# Altium schematic sheet Sheet2.SchDoc
size A4; SheetNumber: 1; SheetTotal: 1
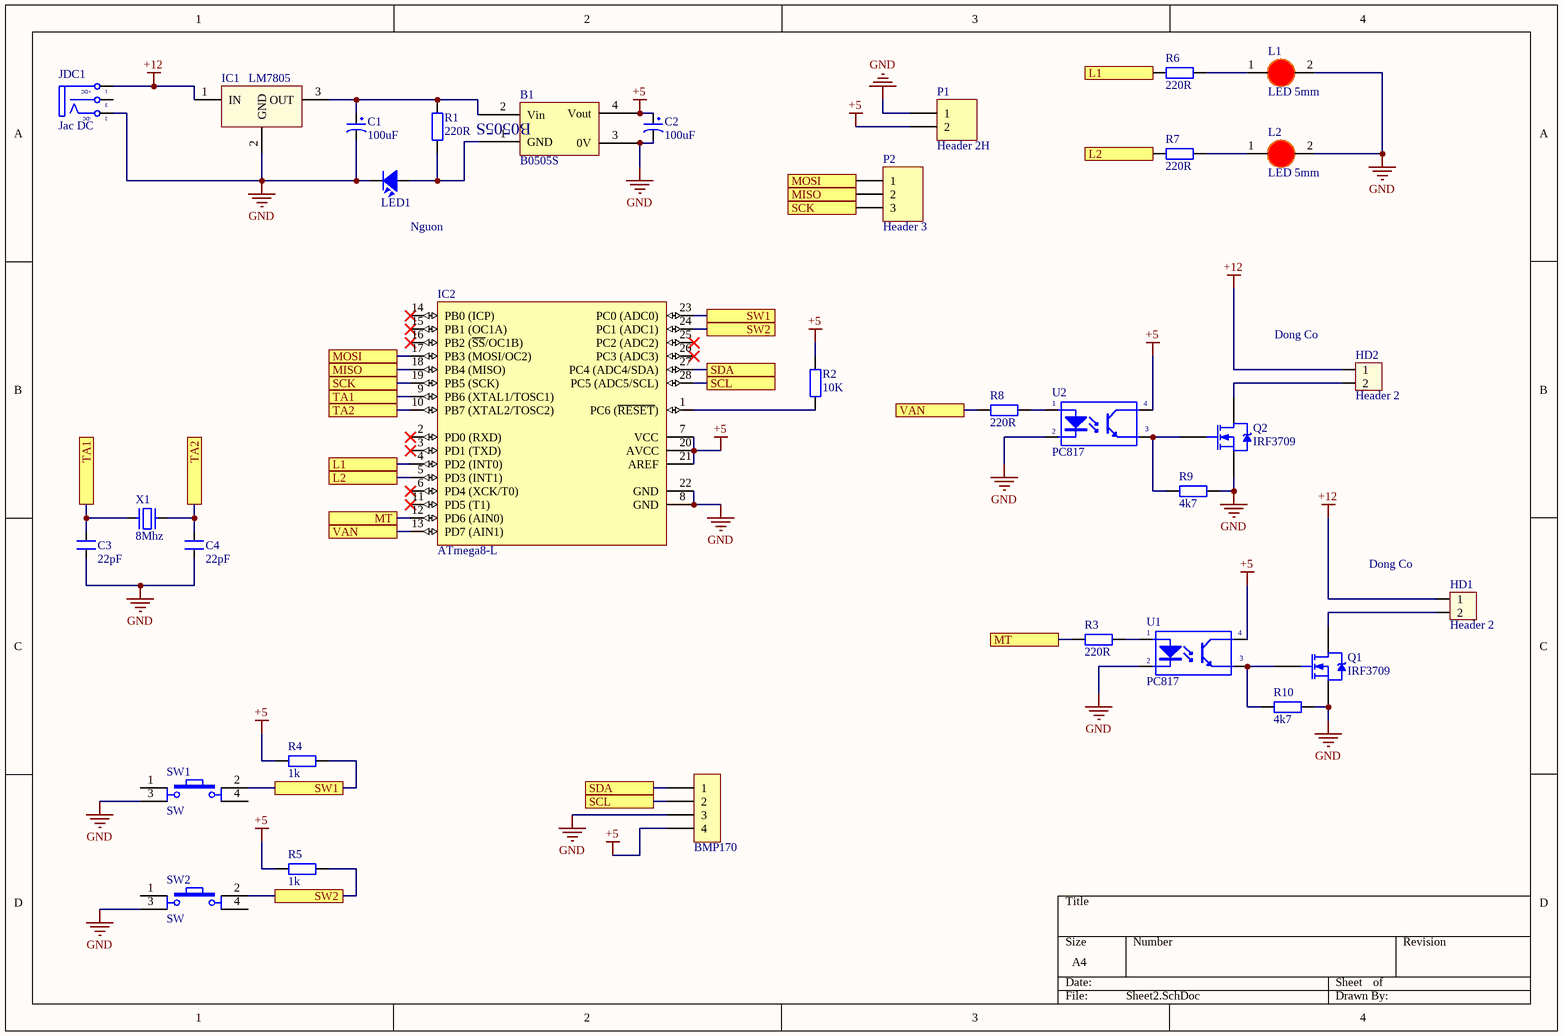
[diagram p0: Sheet2.SchDoc]

## Parts
B1  B0505S  [B0505S]
C1  100uF  [tu hoa 8mm]
C2  100uF  [tu hoa 8mm]
C3  22pF  [CN1]
C4  22pF  [CN1]
H1  BMP170  [XH2.54M-4]
HD1  Header 2  [HED2]
HD2  Header 2  [HED2]
IC1  LM7805  [QTO-220]
IC2  ATmega8-L  [DIP28/W0.3]
JDC1  Jac DC  [DC-IN]
L1  LED 5mm  [LED-5MM-RED]
L2  LED 5mm  [LED-5MM-RED]
LED1  LED  [LED-3]  (value not drawn)
P1  Header 2H  [HDR1X2H]
P2  Header 3  [HDR1X3]
Q1  IRF3709  [TO220]
Q2  IRF3709  [TO220]
R1  220R  [R1/4W]
R2  10K  [R1/4W]
R3  220R  [R1/4W]
R4  1k  [R1/4W]
R5  1k  [R1/4W]
R6  220R  [R1/4W]
R7  220R  [R1/4W]
R8  220R  [R1/4W]
R9  4k7  [R1/4W]
R10  4k7  [R1/4W]
SW1  SW  [SW4]
SW2  SW  [SW4]
U1  PC817  [DIP4/W0.3]
U2  PC817  [DIP4/W0.3]
X1  8Mhz  [XT2]

## Ports
L1, L2, MISO, MOSI, MT, SCK, SCL, SDA, SW1, SW2, TA1, TA2, VAN

## Nets
+5: B1.4(Vout) C2.1 H1.4 IC2.7(VCC) IC2.20(AVCC) IC2.21(AREF) P1.2 R2.2 R4.2 R5.2 U1.4(C) U2.4(C)
+12: HD1.1 HD2.1 IC1.1(IN) JDC1.1(T)
GND: B1.3(0V) C1.2 C2.2 C3.1 C4.1 H1.3 IC1.2(GND) IC2.8(GND) IC2.22(GND) JDC1.2(TN) L1.2(K) L2.2(K) LED1.2 P1.1 Q1.3(S) Q2.3(S) R9.2 R10.2 SW1.3 SW2.3 U1.2(K) U2.2(K)
L1: IC2.4(PD2_(INT0)) R6.1 ; port L1
L2: IC2.5(PD3_(INT1)) R7.1 ; port L2
MISO: IC2.18(PB4_(MISO)) P2.2 ; port MISO
MOSI: IC2.17(PB3_(MOSI/OC2)) P2.1 ; port MOSI
MT: IC2.12(PD6_(AIN0)) R3.1 ; port MT
SCK: IC2.19(PB5_(SCK)) P2.3 ; port SCK
SCL: H1.2 IC2.28(PC5_(ADC5/SCL)) ; port SCL
SDA: H1.1 IC2.27(PC4_(ADC4/SDA)) ; port SDA
SW1: IC2.23(PC0_(ADC0)) R4.1 SW1.2 ; port SW1
SW2: IC2.24(PC1_(ADC1)) R5.1 SW2.2 ; port SW2
TA1: C3.2 IC2.9(PB6_(XTAL1/TOSC1)) X1.1 ; port TA1
TA2: C4.2 IC2.10(PB7_(XTAL2/TOSC2)) X1.2 ; port TA2
VAN: IC2.13(PD7_(AIN1)) R8.1 ; port VAN
NetB1_1: B1.1(GND) LED1.1 R1.2
NetB1_2: B1.2(Vin) C1.1 IC1.3(OUT) R1.1
NetHD1_2: HD1.2 Q1.2(D)
NetHD2_2: HD2.2 Q2.2(D)
NetIC2_1: IC2.1(PC6_(~{RESET})) R2.1
NetL1_1: L1.1(A) R6.2
NetL2_1: L2.1(A) R7.2
NetQ1_1: Q1.1(G) R10.1 U1.3(E)
NetQ2_1: Q2.1(G) R9.1 U2.3(E)
NetR3_2: R3.2 U1.1(A)
NetR8_2: R8.2 U2.1(A)

Not connected (* = marked no-connect by the designer): IC2 2(PD0_(RXD))* 3(PD1_(TXD))* 6(PD4_(XCK/T0))* 11(PD5_(T1))* 14(PB0_(ICP))* 15(PB1_(OC1A))* 16(PB2_(~{SS}/OC1B))* 25(PC2_(ADC2))* 26(PC3_(ADC3))*; JDC1 3(S); SW1 1 4; SW2 1 4

## Notes on the sheet
- (near LED1) Nguon
- (near HD2) Dong Co
- (near HD1) Dong Co
- (in symbol DCIN) +DC; -DC

## Library data of the parts
B1 = B0505S: Cắm; Ten_Linh_Kien: B0505S-1W SIP4 IC Converter DC-DC; Don_Vi: Con; Ma_Hang: MH003143; Ghi_Chu: *; Kieu_Chan: *; Chung_Loai: Cắm
C1 C2 = Tu Hoa 100uF 35V 8x11: Cắm; Don_Vi: Con; So_Chan: 2; Ten_Linh_Kien: Tụ Hóa 100uF 35V 8x11MM; Ma_Hang: MH002807; Chung_Loai: Cắm; Kieu_Chan: *
C3 C4 = CN1: Cap np  1pF - 472pF; Value: 100pF
H1 = Header 4P 2.54 Duc Thang: Cắm; Ten_Linh_Kien: Header 4P XH2.54-4P Đực Thẳng; Don_Vi: Con; Ma_Hang: MH001285; Chung_Loai: Cắm
HD1 HD2 = Hed2: Header 2 (Green); Value: Header 2
IC1 = LM78xx: On ap +, from + 5 to + 24VDC; Value: LM7805
IC2 = ATmega8-L: 8-Bit AVR Microcontroller with 8K Bytes of In-System Programmable Flash Memory; Value: ATmega8-L
JDC1 = DCIN: Jac DC input; Value: Jac DC
L1 L2 = LED 5mm Do: Cắm; Don_Vi: Con; Ma_Hang: MH008967; Ten_Linh_Kien: Led 5MM Phủ Đỏ (1000c); Ghi_Chu: *; Kieu_Chan: *; Chung_Loai: Cắm
LED1 = LED: LED Single colour Green and Red; Value: LED 3 ly Single Colour
P1 = Header 2H: Header, 2-Pin, Right Angle; LatestRevisionDate: 17-Jul-2002; LatestRevisionNote: Re-released for DXP Platform.; Publisher: Altium Limited
P2 = Header 3: Header, 3-Pin; LatestRevisionDate: 17-Jul-2002; LatestRevisionNote: Re-released for DXP Platform.; Publisher: Altium Limited
Q1 Q2 = IRF3709 DIP: N-Channel Power MOSFET
R1-R10 = R1/4W: Resistor 1/4W; Value: R1/4W - 1K
SW1 SW2 = SW4: Switch button 4 pin; Value: Button chip 4 pin
U1 U2 = PC817: Single Opto; Value: PC817
X1 = XT2: Crystal For all Crystal 2pin.; Value: 4Mhz